# EAGLE design SparkFun_Pro_Micro (EAGLE 7.3.0)
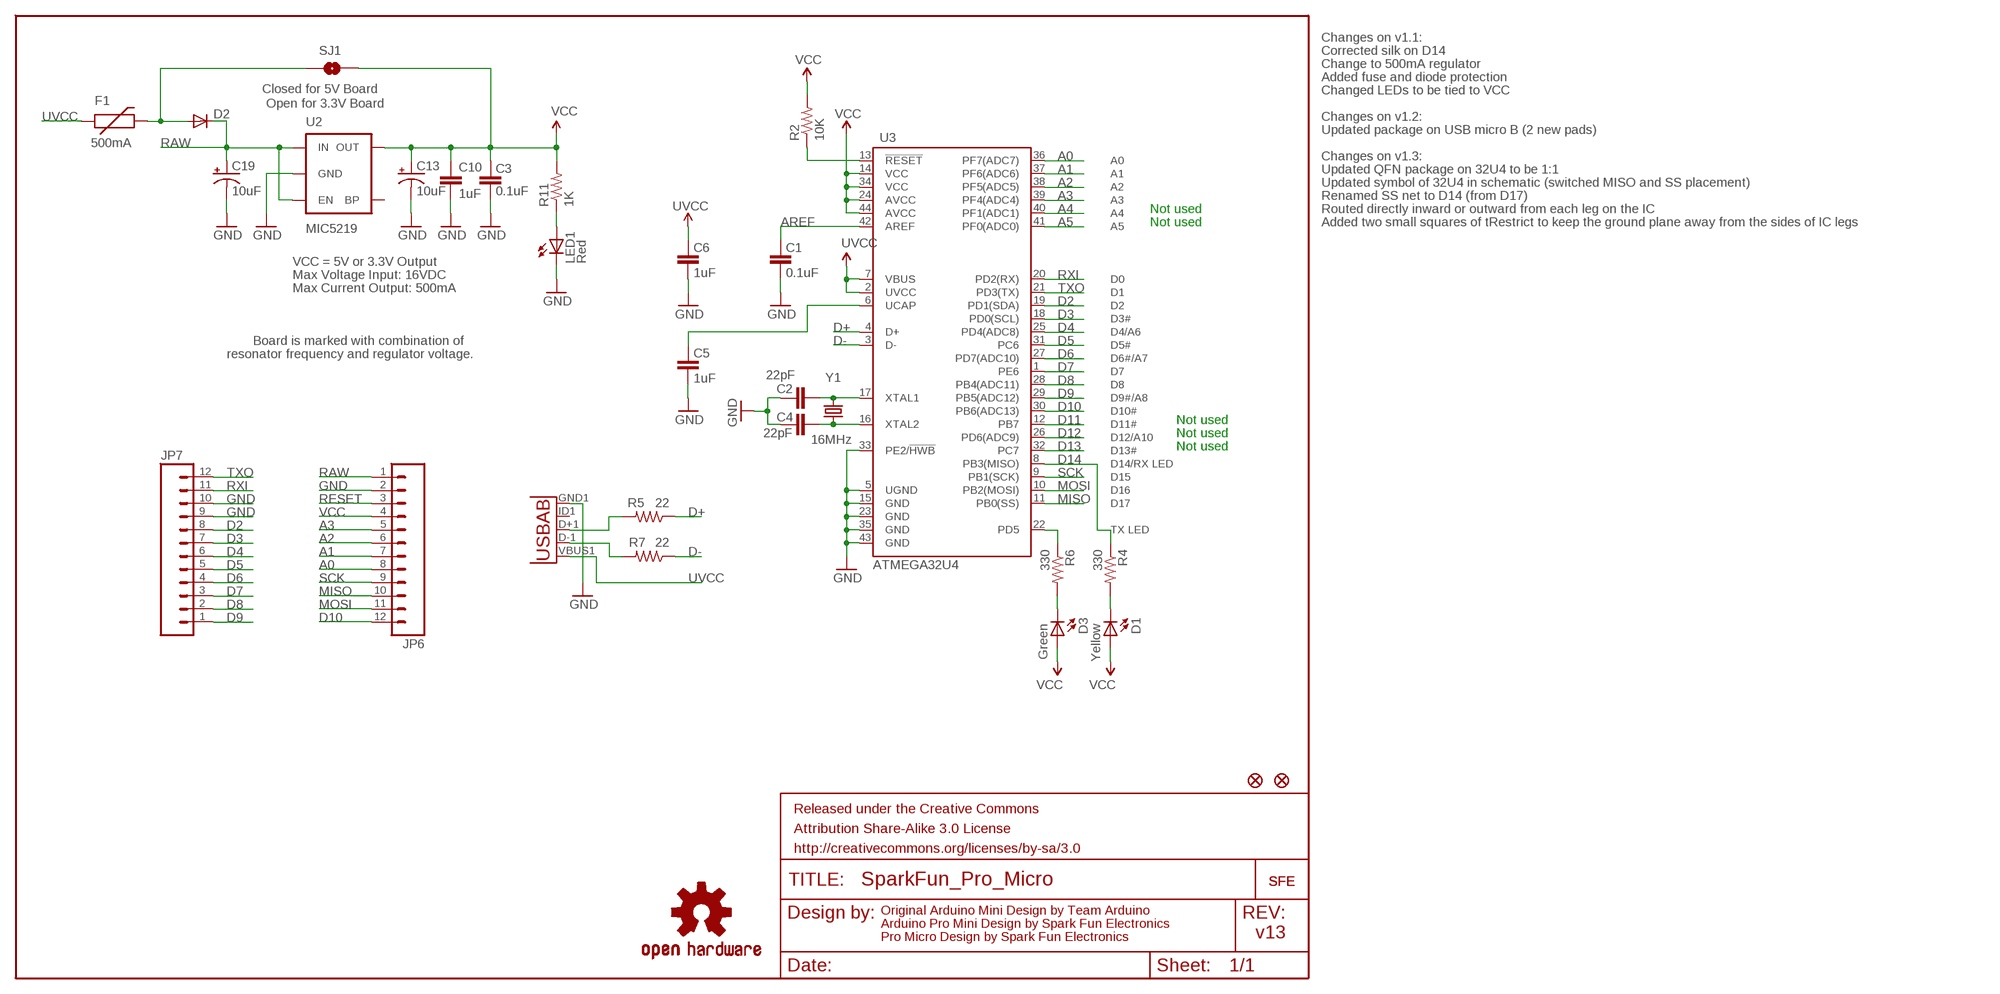
[diagram p0: schematic, sheet 1]

## Parts
C1  0.1uF  CAP0603-CAP  [0603-CAP]
C2  22pF  CAP0603-CAP  [0603-CAP]
C3  0.1uF  CAP0603-CAP  [0603-CAP]
C4  22pF  CAP0603-CAP  [0603-CAP]
C5  1uF  CAP0603-CAP  [0603-CAP]
C6  1uF  CAP0603-CAP  [0603-CAP]
C10  1uF  CAP0603-CAP  [0603-CAP]
C13  10uF  CAP_POL1206  [EIA3216]
C19  10uF  CAP_POL1206  [EIA3216]
D1  Yellow  LED0603  [LED-0603]
D2  DIODESOD  [SOD-323]
D3  Green  LED0603  [LED-0603]
F1  500mA  PTCSMD  [PTC-1206]
FRAME1  FRAME-LETTER  [CREATIVE_COMMONS]
JP1  FIDUCIALUFIDUCIAL  [MICRO-FIDUCIAL]
JP2  FIDUCIALUFIDUCIAL  [MICRO-FIDUCIAL]
JP6  M12PTH  [1X12]
JP7  M12PTH  [1X12]
LED1  Red  LED0603  [LED-0603]
R2  10K  RESISTOR0603-RES  [0603-RES]
R4  330  RESISTOR0603-RES  [0603-RES]
R5  22  RESISTOR0603-RES  [0603-RES]
R6  330  RESISTOR0603-RES  [0603-RES]
R7  22  RESISTOR0603-RES  [0603-RES]
R11  1K  RESISTOR0603-RES  [0603-RES]
SJ1  Closed for 5V Board  SOLDERJUMPERNC  [SJ_2S]
U2  MIC5219  V_REG_LDOSMD  [SOT23-5]
U3  ATMEGA32U4  ATMEGA32U4OUTFAKES  [QFN-44-NOPAD_1:1-OUTFAKES]
U$1  LOGO-SFESK  [SFE-LOGO-FLAME]
U$3  OSHW-LOGOS  [OSHW-LOGO-S]
U$11  LOGO-SFENEW  [SFE-NEW-WEBLOGO]
X1  USB-ABIN&OUT  [USB-AB-MICRO-SMD-V03-IN&OUT]
Y1  16MHz  CRYSTAL5X3  [CRYSTAL-SMD-5X3]

## Nets
A0: JP6.8 U3.36(PF7(ADC7))
A1: JP6.7 U3.37(PF6(ADC6))
A2: JP6.6 U3.38(PF5(ADC5))
A3: JP6.5 U3.39(PF4(ADC4))
A4: U3.40(PF1(ADC1))
A5: U3.41(PF0(ADC0))
AREF: C1.2 U3.42(AREF)
D2: JP7.8 U3.19(PD1(SDA))
D3: JP7.7 U3.18(PD0(SCL))
D4: JP7.6 U3.25(PD4(ADC8))
D5: JP7.5 U3.31(PC6)
D6: JP7.4 U3.27(PD7(ADC10))
D7: JP7.3 U3.1(PE6)
D8: JP7.2 U3.28(PB4(ADC11))
D9: JP7.1 U3.29(PB5(ADC12))
D10: JP6.12 U3.30(PB6(ADC13))
D11: U3.12(PB7)
D12: U3.26(PD6(ADC9))
D13: U3.32(PC7)
D14: R4.1 U3.8(PB3(MISO))
D+: R5.1 U3.4(D+)
D-: R7.1 U3.3(D-)
GND [vcc]: C1.1 C2.2 C3.1 C4.2 C5.1 C6.1 C10.2 C13.C(-) C19.C(-) JP6.2 JP7.9 JP7.10 LED1.C U2.2(GND) U3.5(UGND) U3.15(GND) U3.23(GND) U3.33(PE2/!HWB) U3.35(GND) U3.43(GND) X1.GND1(GND)
MISO: JP6.10 U3.11(PB0(SS))
MOSI: JP6.11 U3.10(PB2(MOSI))
N$1: C4.1 U3.16(XTAL2) Y1.1
N$2: C2.1 U3.17(XTAL1) Y1.3
N$3: D2.2(A) F1.2 SJ1.1
N$4: C5.2 U3.6(UCAP)
N$5: D1.C R4.2
N$6: R7.2 X1.D-1(D-)
N$7: D3.C R6.2
N$8: R5.2 X1.D+1(D+)
N$38: LED1.A R11.1
RAW [vcc]: C19.A(+) D2.1(C) JP6.1 U2.1(IN) U2.3(EN)
RESET: JP6.3 R2.1 U3.13(!RESET)
RXI: JP7.11 U3.20(PD2(RX))
SCK: JP6.9 U3.9(PB1(SCK))
TXLED: R6.1 U3.22(PD5)
TXO: JP7.12 U3.21(PD3(TX))
UVCC: C6.2 F1.1 U3.2(UVCC) U3.7(VBUS) X1.VBUS1(VBUS)
VCC: C3.2 C10.1 C13.A(+) D1.A D3.A JP6.4 R2.2 R11.2 SJ1.2 U2.5(OUT) U3.14(VCC) U3.24(AVCC) U3.34(VCC) U3.44(AVCC)
Unconnected: U2.4(BP) X1.ID1(USBID)

## Notes on the sheet
- Changes on v1.1:
- Corrected silk on D14
- Change to 500mA regulator
- Added fuse and diode protection
- Changed LEDs to be tied to VCC
- Open for 3.3V Board
- Changes on v1.2:
- Updated package on USB micro B (2 new pads)
- Changes on v1.3:
- Updated QFN package on 32U4 to be 1:1
- Updated symbol of 32U4 in schematic (switched MISO and SS placement)
- Renamed SS net to D14 (from D17)
- Not used | Routed directly inward or outward from each leg on the IC
- Not used | Added two small squares of tRestrict to keep the ground plane away from the sides of IC legs
- VCC = 5V or 3.3V Output
- Max Voltage Input: 16VDC
- Max Current Output: 500mA
- Board is marked with combination of
- resonator frequency and regulator voltage.
- Not used
- Not used
- Not used
- Original Arduino Mini Design by Team Arduino
- Arduino Pro Mini Design by Spark Fun Electronics
- Pro Micro Design by Spark Fun Electronics | v13

## Library data of the parts
C1-C6 C10 = SparkFun:CAP: Capacitor Standard 0603 ceramic capacitor, and 0.1" leaded capacitor.
C13 C19 = SparkFun:CAP_POL: Capacitor Polarized These are standard SMD and PTH capacitors. Normally 10uF, 47uF, and 100uF in electrolytic and tantalum varieties. Always verify the external diameter of the through hole cap, it varies with capacity, voltage, and manufacturer. The EIA devices should be standard.
D1 D3 LED1 = SparkFun:LED: LEDs Standard schematic elements and footprints for 5mm, 3mm, 1206, and 0603 sized LEDs. 5mm - Spark Fun Electronics SKU : COM-00529 (and others)
D2 = SparkFun:DIODE: Diode These are standard reverse protection diodes and small signal diodes. SMA package can handle up to about 1A. SOD-323 can handle about 200mA. What the SOD-323 package when ordering, there are some mfgs out there that are 5-pin packages.
F1 = SparkFun:PTC: Resettable Fuse PTC Resettable Fuse. Spark Fun Electronics SKU : COM-08357
FRAME1 = SparkFun-Aesthetics:FRAME-LETTER: Schematic Frame Standard 8.5x11 US Letter frame
JP1 JP2 = SparkFun:FIDUCIAL: Fiducial Alignment Points Various fiducial points for machine vision alignment.
JP6 JP7 = SparkFun:M12: Header 12 Standard 12-pin 0.1" header. Use with straight break away headers (SKU : PRT-00116), right angle break away headers (PRT-00553), swiss pins (PRT-00743), machine pins (PRT-00117), and female headers (PRT-00115).
R2 R4-R7 R11 = SparkFun:RESISTOR: Resistor Basic schematic elements and footprints for 0603, 1206, and PTH resistors.
SJ1 = SparkFun:SOLDERJUMPER: Solder Jumper Standard SMD solder jumper. Used to automate production. Two varients : Normally Open and Normally Closed are the same, but have different paste layers. NC will have a large amount of paste and should jumper during reflow.
U2 = SparkFun:V_REG_LDO: Voltage Regulator LDO Standard 150mA LDO voltage regulator in SOT-23 layout. Micrel part MIC5205. BP (by-pass) pin is used to lower output noise with 470pF cap.
U3 = Testing:ATMEGA32U4: Atmel 44-pin 8-bit Microcontroller with 32KBytes of ISP Flash and USB Controller
U$1 U$11 = SparkFun:LOGO-SFE: Spark Fun Electronics PCB Logo This is the standard Spark Fun Electronics PCB logo.
U$3 = SparkFun:OSHW-LOGO: Open Source Hardware Logo This logo indicates the piece of hardware it is found on incorporates a OSHW license and/or adheres to the definition of open source hardware found here: http://freedomdefined.org/OSHW
X1 = Testing:USB-AB: This is a USB AB connector that is compatible with USB OTG. i.e. this connector can serve as a host or device
Y1 = SparkFun:CRYSTAL: Crystals Various standard crystals. Proven footprints. Spark Fun Electronics SKU : COM-00534

## Net classes
0 default: width 0.203 mm

## Board
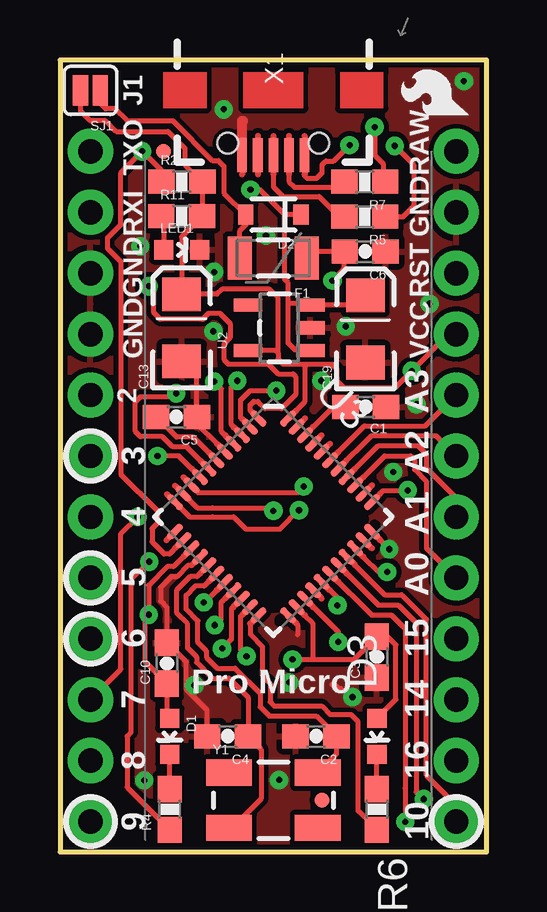
[diagram p1: board, top side]
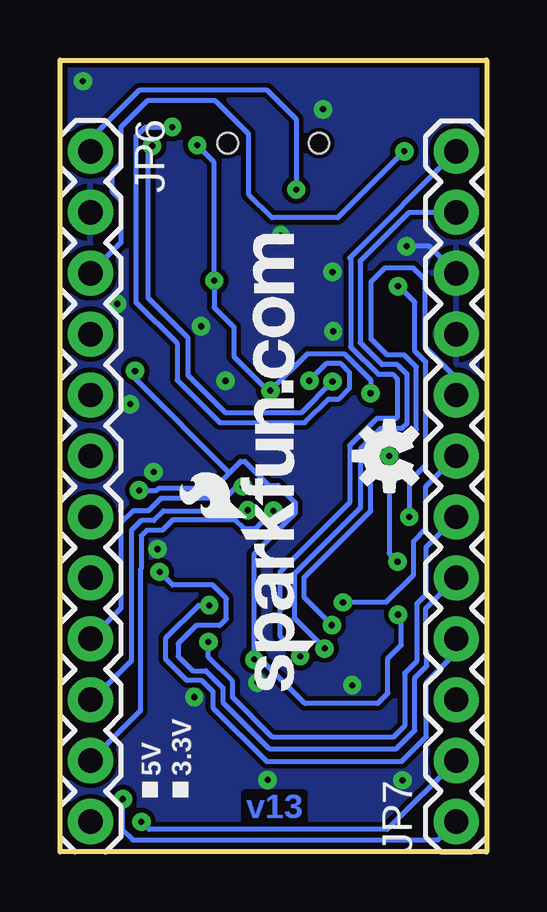
[diagram p2: board, bottom side, seen from below]

Size 17.78 x 33.02 mm. Coordinates in mm from the lower left corner, seen from the top.
Outline: 0,33.02 0,0 17.78,0 17.78,33.02 0,33.02
Copper layers (1*16): Top 0.035mm / dielectric 1.5mm / Bottom 0.035mm
Design rules "SparkFun *": minimum track width 8mil, minimum drill 15mil, track to track 7mil, track to pad 7mil, pad to pad 7mil, via to via 7mil, smd to smd 7mil, copper to edge 7mil, drill to drill 7mil, minimum pad ring 12mil, minimum via ring 10mil, stop-mask expansion 4mil, vias tented up to drill 20mil, thermal gap 10mil
tRestrict: area 9.1,9.6 to 9.3,9.7; area 13.1,13.6 to 13.1,13.7; area 5.5,10.3 to 12.6,17.6

### Footprints (pad centres in the part's own frame; a part is rotated, then mirrored left to right if it is on the bottom)
0603-CAP = smd 1.1 x 1: 1 -0.85,0; 2 0.85,0
EIA3216 = smd 1.4 x 1.6: A 1.4,0; C -1.4,0
LED-0603 = smd 0.8 x 0.8: A 0,-0.75; C 0,0.75
SOD-323 = smd 0.63 x 0.83: 1 -1.15,0; 2 1.15,0
PTC-1206 = smd 1 x 1.8: 1 -1.4,0; 2 1.4,0
MICRO-FIDUCIAL = smd 0.635 x 0.635: 1 0,0
1X12 = drill 1.016 pad 1.88: 1 0,0; 2 2.54,0; 3 5.08,0; 4 7.62,0; 5 10.16,0; 6 12.7,0; 7 15.24,0; 8 17.78,0; 9 20.32,0; 10 22.86,0; 11 25.4,0; 12 27.94,0
0603-RES = smd 1.1 x 1: 1 -0.85,0; 2 0.85,0
SJ_2S = smd 0.635 x 1.27: 1 -0.412,0; 2 0.412,0
SOT23-5 = smd 0.55 x 1.2: 1 -0.95,-1.3; 2 0,-1.3; 3 0.95,-1.3; 4 0.95,1.3; 5 -0.95,1.3
QFN-44-NOPAD_1:1-OUTFAKES = smd 0.8 x 0.3: 1 -3.337,2.465; 2 -3.337,1.972; 3 -3.337,1.479; 4 -3.337,0.986; 5 -3.337,0.493; 6 -3.337,0; 7 -3.337,-0.493; 8 -3.337,-0.986; 9 -3.337,-1.479; 10 -3.337,-1.972; 11 -3.337,-2.465; 23 3.337,-2.465; 24 3.337,-1.972; 25 3.337,-1.479; 26 3.337,-0.986; 27 3.337,-0.493; 28 3.337,0; 29 3.337,0.493; 30 3.337,0.986; 31 3.337,1.479; 32 3.337,1.972; 33 3.337,2.465 | smd 0.3 x 0.8: 12 -2.465,-3.337; 13 -1.972,-3.337; 14 -1.479,-3.337; 15 -0.986,-3.337; 16 -0.493,-3.337; 17 0,-3.337; 18 0.493,-3.337; 19 0.986,-3.337; 20 1.479,-3.337; 21 1.972,-3.337; 22 2.465,-3.337; 34 2.465,3.337; 35 1.972,3.337; 36 1.479,3.337; 37 0.986,3.337; 38 0.493,3.337; 39 0,3.337; 40 -0.493,3.337; 41 -0.986,3.337; 42 -1.479,3.337; 43 -1.972,3.337; 44 -2.465,3.337
USB-AB-MICRO-SMD-V03-IN&OUT = smd 1.4 x 0.4: D+1 2.7,0; D-1 2.7,0.65; GND1 2.7,-1.3; ID1 2.7,-0.65; VBUS1 2.7,1.3 | hole 0.85: 2.2,1.9; 2.2,-1.9
CRYSTAL-SMD-5X3 = smd 1.9 x 1.1: 1 -1.85,-1.15; 2 1.85,-1.15; 3 1.85,1.15; 4 -1.85,1.15

### Placement (x,y rotation side)
C1  12.74,18.56 180 top
C2  10.67,4.83 180 top
C3  13.21,8.13 90 top
C4  6.99,4.83 180 top
C5  4.85,18.14 180 top
C6  12.71,25.03 180 top
C10  4.46,7.87 90 top
C13  5.07,21.85 90 top
C19  12.72,21.8 90 top
D1  4.57,4.83 180 top
D2  8.89,26.57 180 top
D3  13.21,4.83 180 top
F1  8.89,24.77 180 top
FRAME1  -17.25,-10.16 0 top  (outside the outline)
JP1  10.92,2.16 0 top
JP2  4.32,29.21 0 top
JP6  16.51,29.21 270 bottom
JP7  1.27,1.27 90 bottom
LED1  5.07,25.11 270 top
R2  5.08,27.94 0 top
R4  4.57,1.78 90 top
R5  12.7,26.49 180 top
R6  13.21,1.78 90 top
R7  12.7,27.94 180 top
R11  5.07,26.5 0 top
SJ1  1.27,31.75 180 top
U2  9.14,21.85 90 top
U3  8.89,13.97 315 top
U$1  17.02,30.73 90 top
U$3  4.06,16.51 90 bottom
U$11  7.11,6.73 90 bottom
X1  8.89,31.75 270 top
Y1  8.89,2.16 0 top

### Tracks (layer width: path | path; a pad name or v marks a point on that pad's centre or on a via)
A0
  Top 0.203: U3.36 13.53,16.52 14.61,16.52 14.78,16.35 14.78,15.94 15.27,15.45 15.27,12.67 JP6.8
A1
  Top 0.203: U3.37 13.26,16.95 14.91,16.95 15.27,16.59 15.27,16.01 16.51,14.77 JP6.7
A2
  Top 0.203: U3.38 12.98,17.36 15.66,17.36 JP6.6
A3
  Top 0.203: 12.68,17.77 12.69,17.77 | 11.6,16.68 12.69,17.77 | 12.69,17.77 15.22,17.77 JP6.5
AREF
  Top 0.203: 10.55,17.72 11.39,18.56 C1.2
D2  (via drill 0.25)
  Top 0.203: 6.88,10.56 6.71,10.39 6.71,9.72 v6.45,9.46
  Bottom 0.203: v6.45,9.46 7.62,10.63 7.62,11.43 4.83,14.22 4.83,16.69 4.23,17.29 3.28,17.29 2.93,17.63 2.93,20.22 3.44,20.73 4.15,20.73 4.82,21.4 4.82,23.77 4.83,23.77 4.25,24.35 3.06,24.35 2.55,23.85 2.55,21.05 1.27,19.76 JP7.8
D3  (via drill 0.25)
  Top 0.203: 6.53,10.91 6.02,10.41 v5.99,10.41
  Bottom 0.203: JP7.7 2.54,15.24 2.54,13.46 3.05,12.95 3.05,11.56 4.2,10.41 v5.99,10.41
D4  (via drill 0.25)
  Top 0.203: 10.55,10.22 11.6,9.17 v11.6,8.76
  Bottom 0.203: JP7.6 2.54,12.7 2.54,10.72 2.92,10.34 2.92,7.95 3.42,7.45 3.42,5.26 3.89,4.79 8.93,4.79 10.58,6.45 10.58,7.1 11.6,8.12 v11.6,8.76
D5  (via drill 0.25)
  Top 0.203: 12.64,12.31 13.28,11.68 v13.63,11.68
  Bottom 0.203: JP7.5 2.54,10.16 2.54,8.38 2.5,8.34 2.5,7.76 3,7.27 3,5.07 3.76,4.3 9.05,4.3 11,6.25 11,6.86 11.01,6.86 11.71,7.55 12.25,7.55 12.86,8.16 12.86,8.69 12.11,9.44 11.13,9.44 10.85,9.73 10.85,10.57 11.41,11.13 13.09,11.13 v13.63,11.68
D6  (via drill 0.25)
  Top 0.203: v11.56,10.29 11.56,10.6 v11.56,10.29 | U3.27 11.56,10.61 v11.56,10.29
  Bottom 0.203: v11.56,10.29 12.01,10.29 13.37,8.92 13.37,8.03 12.49,7.15 11.87,7.15 11.41,6.69 11.41,6.02 9.17,3.78 3.53,3.78 2.51,4.8 2.51,7.07 1.27,8.31 JP7.4
D7  (via drill 0.25)
  Top 0.203: JP7.3 2.54,7.62 2.54,13.28 v3.23,13.97 | v3.7,23.59 3.7,23.54 3.91,23.32 3.91,22.48 4.17,22.22 5.95,22.22 6.19,22.46 6.66,22.46 7.09,22.04 7.09,21.44 6.84,21.2 6.84,20.51 7.03,20.33 8.71,20.33 8.71,20.31 9.1,19.93 9.72,19.93 9.82,19.83 9.82,19.07 9.24,18.49 8.54,18.49 8.24,18.79 8.07,18.79 7.92,18.64 7.92,18.43 U3.1 7.93,18.42
  Bottom 0.203: v3.7,23.59 3.67,23.59 3,22.92 3,20.89 2.54,20.43 2.54,16.13 3.23,15.44 v3.23,13.97
D8  (via drill 0.25)
  Top 0.203: U3.28 12.98,9.88 13.8,9.88 14.38,9.31 14.38,2.67 14.39,2.65 v14.39,1.26
  Bottom 0.203: JP7.2 4.14,0.94 14.07,0.94 v14.39,1.26
D9  (via drill 0.25)
  Top 0.203: 11.95,11.61 13.26,10.3 14.08,10.3 14.83,9.55 14.83,2.49 15.12,2.21 v15.16,2.21
  Bottom 0.203: JP7.1 2.03,0.51 14.76,0.51 15.16,0.91 v15.16,2.21
D10
  Top 0.203: JP6.12 16.51,1.96 15.27,3.2 15.27,9.7 14.24,10.73 13.53,10.73 U3.30
D14  (via drill 0.25)
  Top 0.203: R4.1 2.79,2.71 2.79,4.83 2.95,4.98 2.95,11.34 v3.72,12.1 | 5.5,15.97 4.96,16.51 v4.06,16.51
  Bottom 0.203: v4.06,16.51 4.06,12.45 v3.72,12.1
D+  (via drill 0.25)
  Top 0.203: v13.95,29.44 14.73,28.65 14.73,26.92 14.29,26.49 R5.1 | U3.4 6.72,17.53 6.72,19.32 v6.43,19.61
  Bottom 0.203: v13.95,29.44 14.1,29.29 14.1,23.09 12.45,21.44 12.45,19.88 10.91,18.34 10.91,18.32 7.72,18.32 v6.43,19.61
D-  (via drill 0.25)
  Top 0.203: 13.55,28.26 R7.1 13.46,28.03 13.46,28.7 13.11,29.06 v13.11,30.23 | v7.39,19.65 7.14,19.39 7.14,17.81 7.24,17.71
  Bottom 0.203: v13.11,30.23 14.22,30.23 14.61,29.84 14.61,22.91 12.9,21.21 12.9,19.67 11.12,17.9 7.57,17.9 6.58,18.89 6.18,18.89 6.17,18.88 5.72,19.34 5.72,20 6.07,20.36 6.68,20.36 v7.39,19.65
GND  (via drill 0.25)
  Top 0.203: v13.71,12.62 v13.72,12.62 | U3.33 13.65,12.7 13.97,12.7 | C3.1 13.21,7.47 | 5.49,11.96 5.36,11.96 4.9,11.5 4.66,11.5 4.2,11.03 4.2,10.46 4.46,10.2 C10.2 4.63,8.55 4.64,8.55 5.26,7.92 5.26,6.78 6.13,5.91 C4.2 | 9.86,9.52 9.91,9.47 9.91,9.07 | 11.34,6.98 arc-21 v12.19,6.46 | 5.38,20.45 C13.C 5.7,19.82 C5.1 5.7,17.85 6.54,17.02
  Top 0.406: X1.GND1 7.59,30.48 7.62,30.48
  Bottom 0.203: JP7.10 2.39,25.25 v3.34,25.25
  other vias: 9.13,3 14.86,18.67 11.9,21.92 13.88,15.84 10.88,19.65 6.39,21.71 16.83,32.13 8.58,25.7 15.4,22.85 6.82,30.96 3.51,2.99 5.6,6.95 6.43,24.18 9.56,7.06
  pour Top (isolate 0.203): 0,33.02 17.78,33.02 17.78,0 0,0
  pour Bottom (isolate 0.203): 0,33.02 17.78,33.02 17.78,0 0,0
MISO  (via drill 0.25)
  Top 0.203: v9.96,14.25 9.17,13.46 7.75,13.46 7.24,13.97 6.35,13.97 5.42,13.97 5.4,13.97 U3.11
  Bottom 0.203: JP6.10 16.43,6.35 14.81,7.98 14.81,13.41 14.4,13.82 13.87,13.82 13.46,14.22 9.98,14.22 v9.96,14.25
MOSI  (via drill 0.25)
  Top 0.203: v8.89,14.22 8.76,14.35 6.35,14.35 5.74,14.35 5.72,14.35 U3.10
  Bottom 0.203: JP6.11 14.43,5.89 14.43,11.79 14.4,11.81 14.4,13.18 14.17,13.41 13.51,13.41 13.08,13.84 10.49,13.84 10.11,13.46 9.65,13.46 v8.89,14.22
N$1
  Top 0.203: Y1.1 7.17,1.01 8.38,2.22 8.38,4.28 C4.1 7.83,6.45 7.05,7.24 6.35,7.24 5.69,7.9 5.69,8.14 5.32,8.51 5.32,9.51 4.85,9.98 4.85,10.9 | 5.83,11.61 5.71,11.49 5.44,11.49 4.85,10.9 | 4.85,10.9
N$2
  Top 0.203: Y1.3 11.52,4.09 C2.1 10.68,5.67 8.71,5.67 8.34,6.04 8.34,6.61 7.29,7.67 6.55,7.67 6.1,8.12 6.1,8.37 5.74,8.73 5.74,9.64 5.25,10.13 5.25,10.71 5.63,11.09 6,11.09 6.18,11.26
N$3
  Top 0.203: F1.2 7.49,25.91 7.74,26.16 D2.2 6.83,27.48 6.83,28.6 6.6,28.83 6.35,28.83 4.7,30.48 2.79,30.48 2.29,30.99 1.91,30.99 1.68,31.21 SJ1.1
N$4
  Top 0.203: C5.2 4.03,18.14 4.86,17.3 5.56,17.3 U3.6
N$5
  Top 0.203: R4.2 D1.C
N$6
  Top 0.203: X1.D-1 9.54,27.95 9.78,27.71 11.65,27.71 11.85,27.91 R7.2
N$7
  Top 0.203: R6.2 D3.C
N$8
  Top 0.203: X1.D+1 8.89,27.74 9.3,27.33 10.79,27.33 11.64,26.49 R5.2
N$38
  Top 0.203: R11.1 4.32,26.4 LED1.A
RAW  (via drill 0.25)
  Top 0.203: 9.51,22.86 9.51,21.21 9.78,20.94 10.4,20.94 U2.1 | D2.1 9.37,26.57 | 9.37,26.57 8.33,27.61 v7.94,27.61 | C19.A 12.32,22.8 U2.3 10.38,22.86 9.51,22.86 | 9.51,22.86 9.51,23.73 9.36,23.88 9.36,26.56 9.37,26.57
  Bottom 0.203: JP6.1 16.51,29.72 14.48,31.75 9.14,31.75 7.94,30.54 v7.94,27.61
RESET  (via drill 0.25)
  Top 0.203: 4.79,12.66 4.71,12.58 4.71,12.57 4.56,12.42 4.34,12.42 3.83,12.93 3.83,13.49 4.06,13.72 4.06,14.22 2.54,15.75 2.54,24.61 1.98,25.17 1.98,25.59 2.54,26.15 2.54,28.32 v3.43,29.21 4.23,28.41 R2.1
  Bottom 0.203: JP6.3 15.24,25.4 15.24,27.18 15.62,27.56 15.62,28.32 15.24,28.7 15.24,30.23 14.15,31.32 11.3,31.32 9.93,29.95 9.93,27.43 8.94,26.44 6.2,26.44 v3.43,29.21
RXI  (via drill 0.25)
  Top 0.203: 7.23,10.22 7.14,10.13 7.14,8.87 v6.75,8.48
  Bottom 0.203: JP7.11 3.23,26.67 5.27,24.63 5.27,21.23 4.36,20.32 3.72,20.32 3.72,20.31 3.32,19.91 3.32,17.87 3.52,17.67 | v6.75,8.48 8.03,9.76 8.03,11.6 5.26,14.37 5.26,16.82 4.4,17.67 3.52,17.67 | 3.52,17.67 3.51,17.67
SCK  (via drill 0.25)
  Top 0.203: v10.16,15.24 9.91,14.99 6.35,14.99 5.78,14.99 | 5.75,14.99 5.78,14.99 | U3.9 5.78,14.99
  Bottom 0.203: JP6.9 15.24,10.16 15.24,13.72 14.73,14.22 14.1,14.22 13.59,14.73 10.92,14.73 10.41,15.24 v10.16,15.24
TXLED
  Top 0.203: 7.92,9.52 7.93,9.53 7.94,9.53 7.94,9.05 8.44,8.55 8.44,7.34 8.75,7.03 8.75,6.25 8.91,6.09 10.9,6.09 11.27,5.72 12.13,5.72 12.42,5.44 12.42,1.72 R6.1
TXO  (via drill 0.25)
  Top 0.203: 7.58,9.87 7.54,9.83 7.52,9.83 7.52,8.41 v7.77,8.16
  Bottom 0.203: JP7.12 5.71,24.77 5.67,24.72 5.67,21.05 4.53,19.92 3.92,19.92 3.72,19.72 3.72,18.13 3.79,18.06 4.59,18.06 5.71,16.94 5.71,14.57 8.62,11.66 8.62,9.01 v7.77,8.16
UVCC  (via drill 0.25)
  Top 0.203: 10.42,24.89 F1.1 10.56,25.03 C6.2 11.85,24.32 v11.35,23.82 | v12.06,29.46 11.4,28.8 11.07,28.8 10.92,28.65 10.92,28.32 10.69,28.09 10.29,28.09 10.19,28.19 X1.VBUS1 | v9.01,19.23 7.92,19.23 7.52,18.84 7.52,18.11 7.54,18.11 7.59,18.06 | v4.84,19.12 4.7,18.99 3.35,18.99 3.14,18.77 3.14,17.53 3.35,17.32 4.26,17.32 4.68,16.91 5.29,16.91 5.29,16.87 U3.7
  Bottom 0.203: 11.43,23.9 v11.35,23.82 | v11.35,23.82 11.35,28.75 v12.06,29.46 | v11.35,23.82 11.35,22.7 10.54,21.89 10.54,20.65 9.12,19.23 v9.01,19.23 7.46,20.78 5.94,20.78 4.84,19.68 v4.84,19.12
VCC  (via drill 0.25)
  Top 0.203: SJ1.2 0.86,30.89 1.27,30.48 1.91,30.48 2.35,30.04 4.51,30.04 5.21,29.34 5.21,28.66 R2.2 5.92,27.93 R11.2 5.07,25.65 C13.A | C3.2 13.65,8.98 13.99,8.64 13.99,6.36 D3.A | 4.28,7.02 C10.1 | 4.52,5.63 D1.A 4.46,5.69 C10.1 | 5.14,12.31 4.73,11.9 4.47,11.9 3.7,11.12 v3.7,9.9 3.56,9.76 3.56,7.93 C10.1 | 12.97,8.98 C3.2 | 10.2,9.87 10.53,9.54 10.53,8.08 arc90 10.58,8.02 | U3.34 13.47,15.06 14.47,15.06 v14.49,15.08 | C13.A 5.45,23.25 | 9.09,20.8 9.09,23.1 8.73,23.46 6.75,23.46 6.54,23.25 C13.A | 9.09,20.8 arc90 8.98,20.9 U2.5 | 10.28,20.33 11.35,20.33 11.55,20.12 11.55,19.64 11.83,19.36 13.96,19.36 v14.65,20.06 16.18,21.59 JP6.4 16.37,21.59 | 10.28,20.33 9.32,20.33 9.09,20.56 9.09,20.8 | 10.28,20.33 10.22,20.26 10.22,18.78 9.86,18.42 | v9.69,8.02 10.58,8.02 | 10.58,8.02 12.25,8.02 C3.2
  Bottom 0.203: v3.7,9.9 3.56,9.76 3.56,8.63 4.12,8.07 4.12,6.62 4.54,6.19 7.57,6.19 9.41,8.02 v9.69,8.02 arc90 9.7,8.03 9.7,12.41 7.97,14.14 7.97,14.55 8.71,15.29 9.08,15.29 10.08,16.28 10.26,16.28 10.73,15.81 | v14.49,15.08 13.75,15.08 13.66,15.17 11.37,15.17 10.73,15.81 | v14.65,20.06 14.65,19.73 10.73,15.81

### Text on the board
Bottom: v13
tPlace: J1 | TXO | RAW | RXI | GND | GND | RST | GND | VCC | 2 | A3 | 3 | A2 | 4 | A1 | 5 | A0 | 6 | 15 | Pro | Micro | 7 | 14 | 8 | 16 | 9 | 10
bPlace: 3.3V | 5V
tValues: Valid combinations: | 3.3V Reg / 8MHz | 5V Reg / 16MHz | Mark back accordingly
tDocu: N. Seidle, revised by P. Lewis